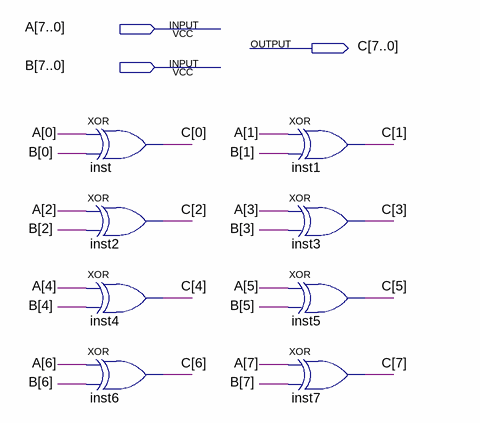
[diagram p0: schematic sheet]
// Quartus schematic XOR2x8.bdf as structural Verilog: 8 symbols, 3 pins
module XOR2x8 (
  input  [7:0] A,
  input  [7:0] B,
  output [7:0] C
);

  xor inst (C[0], A[0], B[0]);
  xor inst2 (C[2], A[2], B[2]);
  xor inst4 (C[4], A[4], B[4]);
  xor inst6 (C[6], A[6], B[6]);
  xor inst1 (C[1], A[1], B[1]);
  xor inst3 (C[3], A[3], B[3]);
  xor inst5 (C[5], A[5], B[5]);
  xor inst7 (C[7], A[7], B[7]);
endmodule
